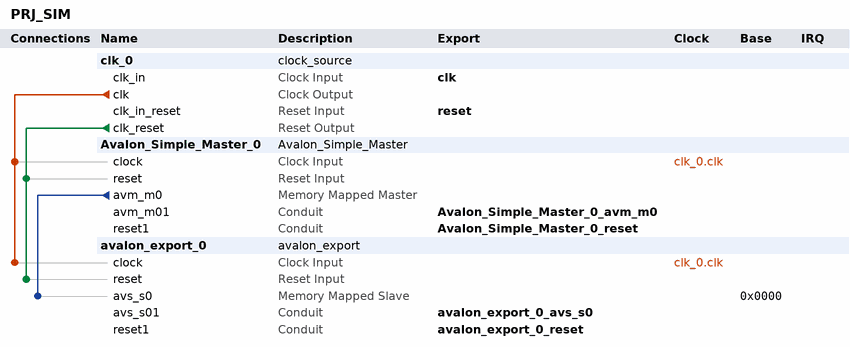
[diagram p0: system contents]
# Platform Designer (Qsys) system PRJ_SIM, Cyclone V 5CSXFC6D6F31C8ES
# Parameters at their usual value, and those the tool derives, are not listed.
package require -exact qsys 17.1
create_system PRJ_SIM
set_project_property DEVICE_FAMILY {Cyclone V}
set_project_property DEVICE 5CSXFC6D6F31C8ES

add_instance clk_0 clock_source 17.1
set_instance_parameter_value clk_0 clockFrequency 50000000

add_instance Avalon_Simple_Master_0 Avalon_Simple_Master 1.0

add_instance avalon_export_0 avalon_export 1.0

# connections
add_connection clk_0.clk avalon_export_0.clock clock
add_connection clk_0.clk Avalon_Simple_Master_0.clock clock
add_connection clk_0.clk_reset avalon_export_0.reset reset
add_connection clk_0.clk_reset Avalon_Simple_Master_0.reset reset
add_connection Avalon_Simple_Master_0.avm_m0 avalon_export_0.avs_s0 avalon
set_connection_parameter_value Avalon_Simple_Master_0.avm_m0/avalon_export_0.avs_s0 baseAddress 0x0000

# exported interfaces
add_interface Avalon_Simple_Master_0_avm_m0 conduit end
set_interface_property Avalon_Simple_Master_0_avm_m0 EXPORT_OF Avalon_Simple_Master_0.avm_m01
add_interface Avalon_Simple_Master_0_reset conduit end
set_interface_property Avalon_Simple_Master_0_reset EXPORT_OF Avalon_Simple_Master_0.reset1
add_interface avalon_export_0_avs_s0 conduit end
set_interface_property avalon_export_0_avs_s0 EXPORT_OF avalon_export_0.avs_s01
add_interface avalon_export_0_reset conduit end
set_interface_property avalon_export_0_reset EXPORT_OF avalon_export_0.reset1
add_interface clk clock sink
set_interface_property clk EXPORT_OF clk_0.clk_in
add_interface reset reset sink
set_interface_property reset EXPORT_OF clk_0.clk_in_reset

set_interconnect_requirement {$system} qsys_mm.clockCrossingAdapter HANDSHAKE
set_interconnect_requirement {$system} qsys_mm.enableEccProtection FALSE
set_interconnect_requirement {$system} qsys_mm.insertDefaultSlave FALSE
set_interconnect_requirement {$system} qsys_mm.maxAdditionalLatency 1

save_system PRJ_SIM.qsys
